# Altium schematic sheet connector_cooler.SchDoc
size A
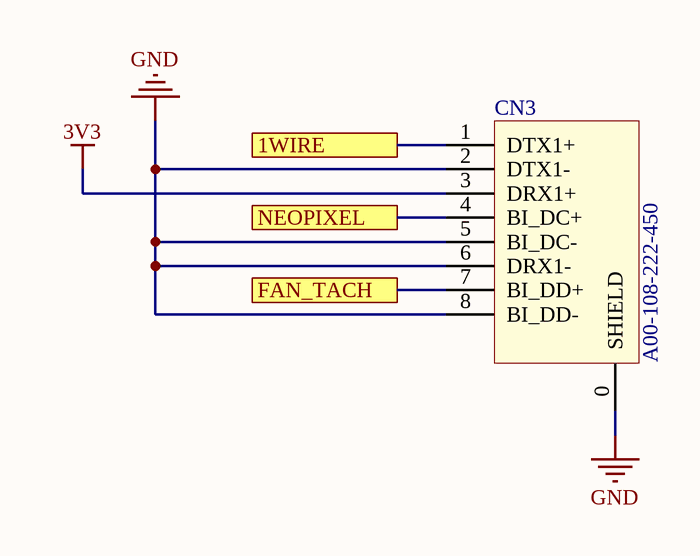
[diagram p0: connector_cooler.SchDoc]

## Parts
CN3  MFG P/N: A00-108-222-450  [RJ45 TOP ENTRY EDAC A00-108-222-450]  (hidden comment: CONN_RJ45_TOP_A00-108-222-450)

## Ports
1WIRE, FAN_TACH, NEOPIXEL

## Nets
3V3: CN3.3(DRX1+)
GND: CN3.0(SHIELD) CN3.2(DTX1-) CN3.5(BI_DC-) CN3.6(DRX1-) CN3.8(BI_DD-)
1WIRE: CN3.1(DTX1+) ; port 1WIRE
FAN_TACH: CN3.7(BI_DD+) ; port FAN_TACH
NEOPIXEL: CN3.4(BI_DC+) ; port NEOPIXEL

## Library data of the parts
CN3 = 492: CONN, RJ-45, 1-PORT, 8-POS, VERT, 0.76um GOLD, TH; ID: 492; MFG: EDAC Inc; COMMON: 210-00203-00; XPN: XS-10003929; Status: In Development; RoHS Compliant: Yes; LOON: 210-00203-00; Gecko: 210-00203-00